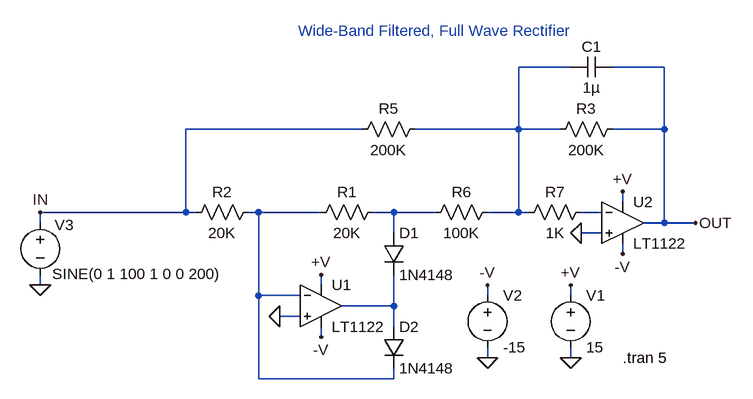
[diagram p0: schematic 1122.asc]
1122.asc, the LTspice schematic file:
Version 4
SHEET 1 896 680
WIRE 448 -128 368 -128
WIRE 592 -128 512 -128
WIRE 128 -32 -144 -32
WIRE 368 -32 368 -128
WIRE 368 -32 208 -32
WIRE 432 -32 368 -32
WIRE 592 -32 592 -128
WIRE 592 -32 512 -32
WIRE 528 80 528 64
WIRE -144 96 -144 -32
WIRE -144 96 -368 96
WIRE -128 96 -144 96
WIRE -32 96 -48 96
WIRE 64 96 -32 96
WIRE 176 96 144 96
WIRE 240 96 176 96
WIRE 368 96 368 -32
WIRE 368 96 320 96
WIRE 384 96 368 96
WIRE 496 96 464 96
WIRE -368 112 -368 96
WIRE 592 112 592 -32
WIRE 592 112 560 112
WIRE 640 112 592 112
WIRE 176 128 176 96
WIRE 496 128 464 128
WIRE 528 160 528 144
WIRE -368 208 -368 192
WIRE 64 208 64 192
WIRE -32 224 -32 96
WIRE 32 224 -32 224
WIRE 320 224 320 208
WIRE 448 224 448 208
WIRE 176 240 176 192
WIRE 176 240 96 240
WIRE 32 256 0 256
WIRE 176 272 176 240
WIRE 64 288 64 272
WIRE 320 320 320 304
WIRE 448 320 448 304
WIRE -32 352 -32 224
WIRE 176 352 176 336
WIRE 176 352 -32 352
FLAG 448 320 0
FLAG 64 192 +V
FLAG 448 208 +V
FLAG 64 288 -V
FLAG 320 320 0
FLAG 320 208 -V
FLAG -368 208 0
FLAG 0 256 0
FLAG 528 64 +V
FLAG 528 160 -V
FLAG 464 128 0
FLAG 640 112 OUT
FLAG -368 96 IN
SYMBOL voltage 448 208 R0
SYMATTR InstName V1
SYMATTR Value 15
SYMBOL voltage 320 208 R0
SYMATTR InstName V2
SYMATTR Value -15
SYMBOL res 160 80 R90
WINDOW 0 0 56 VBottom 2
WINDOW 3 32 56 VTop 2
SYMATTR InstName R1
SYMATTR Value 20K
SYMBOL res -32 80 R90
WINDOW 0 0 56 VBottom 2
WINDOW 3 32 56 VTop 2
SYMATTR InstName R2
SYMATTR Value 20K
SYMBOL voltage -368 96 R0
WINDOW 0 22 19 Left 2
WINDOW 3 18 95 Left 2
WINDOW 123 32 56 VTop 2
WINDOW 39 32 56 VTop 2
SYMATTR InstName V3
SYMATTR Value SINE(0 1 100 1 0 0 200)
SYMBOL opamps\\LT1122 64 176 R0
SYMATTR InstName U1
SYMBOL res 528 -48 R90
WINDOW 0 0 56 VBottom 2
WINDOW 3 32 56 VTop 2
SYMATTR InstName R3
SYMATTR Value 200K
SYMBOL opamps\\LT1122 528 48 R0
SYMATTR InstName U2
SYMBOL diode 160 128 R0
SYMATTR InstName D1
SYMATTR Value 1N4148
SYMBOL diode 160 272 R0
SYMATTR InstName D2
SYMATTR Value 1N4148
SYMBOL res 224 -48 R90
WINDOW 0 0 56 VBottom 2
WINDOW 3 32 56 VTop 2
SYMATTR InstName R5
SYMATTR Value 200K
SYMBOL res 336 80 R90
WINDOW 0 0 56 VBottom 2
WINDOW 3 32 56 VTop 2
SYMATTR InstName R6
SYMATTR Value 100K
SYMBOL res 480 80 R90
WINDOW 0 0 56 VBottom 2
WINDOW 3 32 56 VTop 2
SYMATTR InstName R7
SYMATTR Value 1K
SYMBOL cap 512 -144 R90
WINDOW 0 0 32 VBottom 2
WINDOW 3 32 32 VTop 2
SYMATTR InstName C1
SYMATTR Value 1µ
TEXT 528 320 Left 2 !.tran 5
TEXT 240 -168 Bottom 2 ;Wide-Band Filtered, Full Wave Rectifier

The netlist it stands for:
* 1122.asc
V1 +V 0 15
V2 -V 0 -15
R1 N003 N002 20K
R2 N002 IN 20K
V3 IN 0 SINE(0 1 100 1 0 0 200)
XU1 0 N002 +V -V N005 LT1122  ; pins In+ In- V+ V- OUT
R3 OUT N001 200K
XU2 0 N004 +V -V OUT LT1122  ; pins In+ In- V+ V- OUT
D1 N003 N005 1N4148
D2 N005 N002 1N4148
R5 N001 IN 200K
R6 N001 N003 100K
R7 N004 N001 1K
C1 OUT N001 1µ
.model D D
.lib standard.dio
.tran 5
* Wide-Band Filtered, Full Wave Rectifier
.backanno
.end